# EAGLE design ATSAMD21G18A_Breakout (EAGLE 9.3.2)
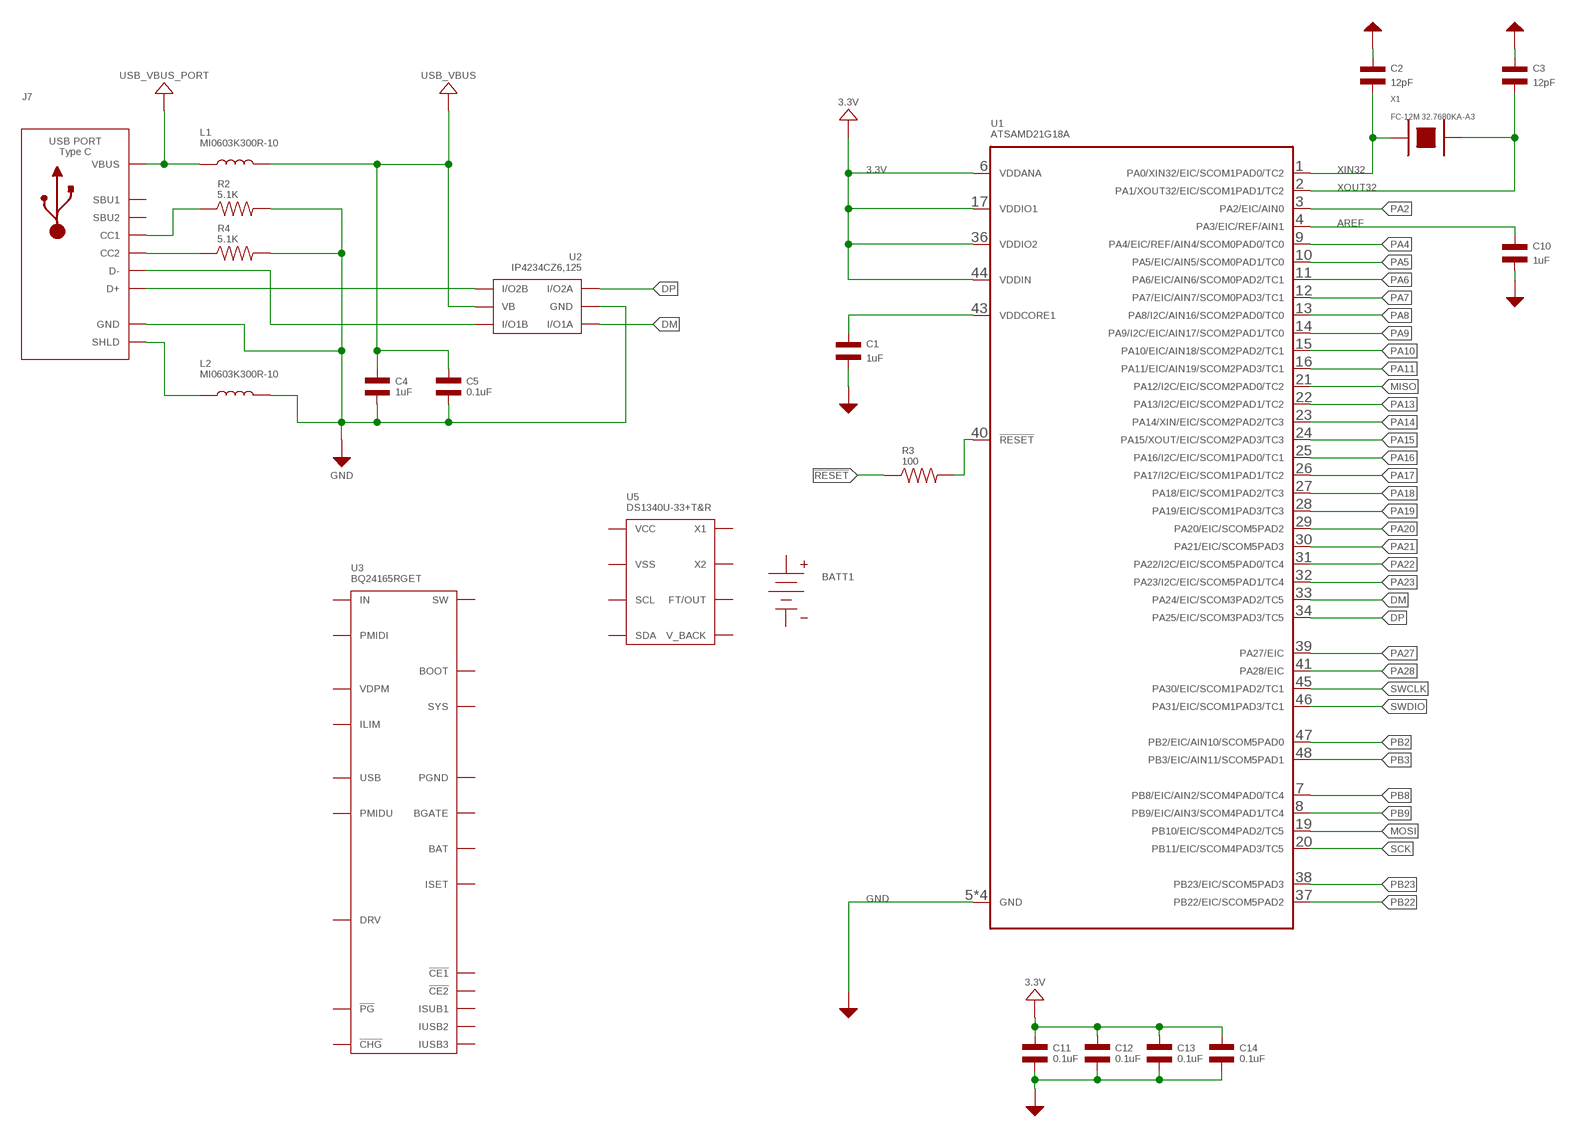
[diagram p0: schematic, sheet 1, part 1 of 2]
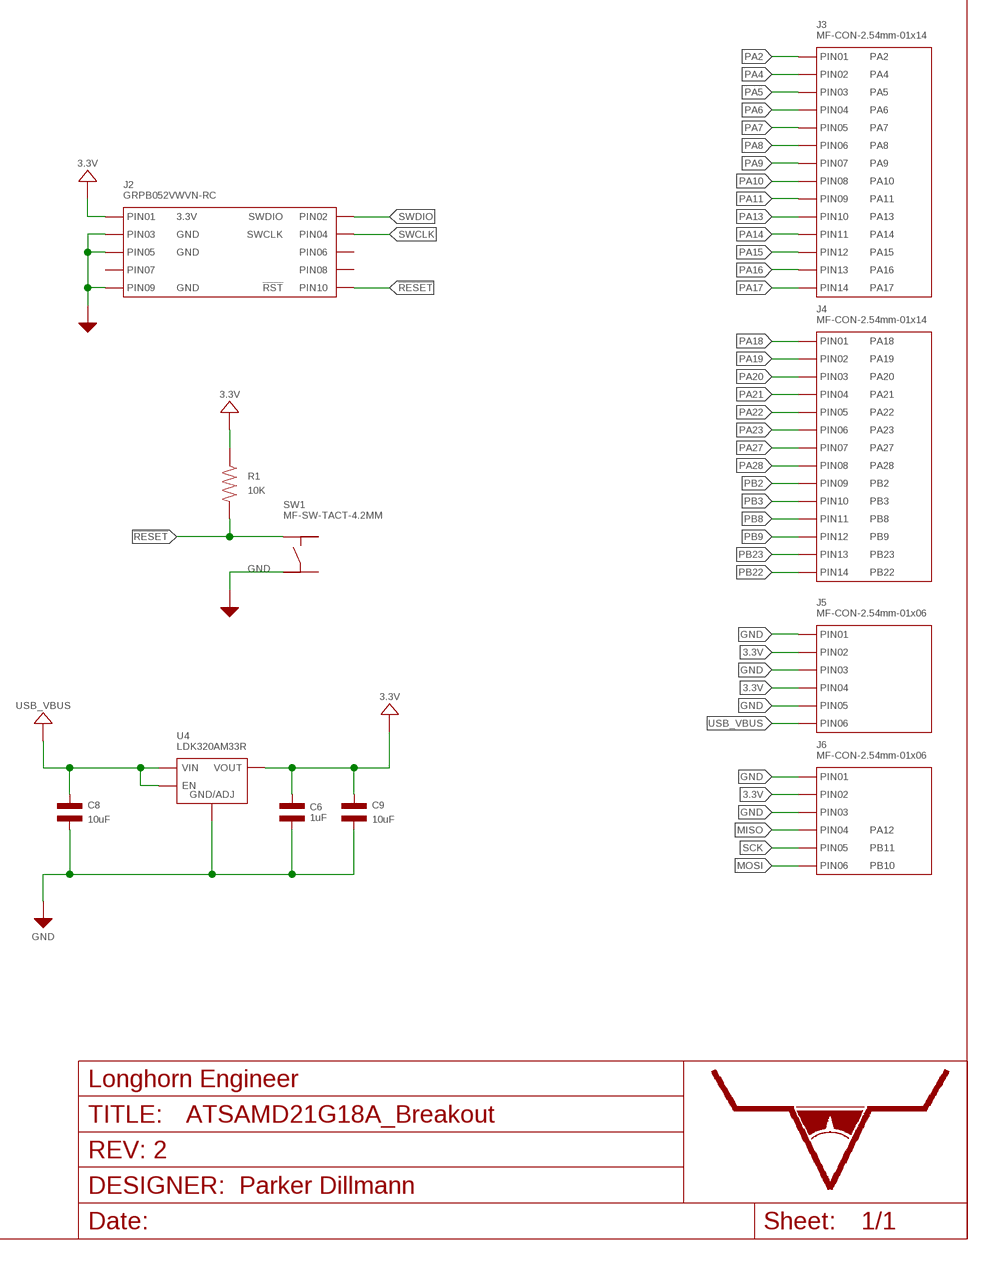
[diagram p1: schematic, sheet 1, part 2 of 2]

## Parts
BATT1  BATTERY_KEYSTONE_1074  [1074]
C1  1uF  CAPACITOR_NP_0402  [C0402]
C2  12pF  CAPACITOR_NP_0402  [C0402]
C3  12pF  CAPACITOR_NP_0402  [C0402]
C4  1uF  CAPACITOR_NP_0402  [C0402]
C5  0.1uF  CAPACITOR_NP_0402  [C0402]
C6  1uF  CAPACITOR_NP_0603  [C0603]
C8  10uF  CAPACITOR_NP_1206  [C1206]
C9  10uF  CAPACITOR_NP_1206  [C1206]
C10  1uF  CAPACITOR_NP_0402  [C0402]
C11  0.1uF  CAPACITOR_NP_0402  [C0402]
C12  0.1uF  CAPACITOR_NP_0402  [C0402]
C13  0.1uF  CAPACITOR_NP_0402  [C0402]
C14  0.1uF  CAPACITOR_NP_0402  [C0402]
J2  GRPB052VWVN-RC  CON_02X05_GRPB052VWVN-RC  [GRPB052VWVN-RC]
J3  MF-CON-2.54mm-01x14  CON_01X14_PTH_2.54MM  [PTH_2.54MM_01X14]
J4  MF-CON-2.54mm-01x14  CON_01X14_PTH_2.54MM  [PTH_2.54MM_01X14]
J5  MF-CON-2.54mm-01x06  CON_01X06_PTH_2.54MM  [PTH_2.54MM_01X06]
J6  MF-CON-2.54mm-01x06  CON_01X06_PTH_2.54MM  [PTH_2.54MM_01X06]
J7  USB_TYPE-C_MINIMAL  [TYPE-C-31-M-12]
L1  MI0603K300R-10  INDUCTOR_0603  [L0603]
L2  MI0603K300R-10  INDUCTOR_0603  [L0603]
R1  10K  RESISTOR_0402  [R0402]
R2  5.1K  RESISTOR_0402  [R0402]
R3  100  RESISTOR_0402  [R0402]
R4  5.1K  RESISTOR_0402  [R0402]
SW1  MF-SW-TACT-4.2MM  TACT_4.2MM  [TACT4.2MM]
U1  ATSAMD21G18A  ATSAMD21G18A-AU  [ATSAMD21G18A_TQFP-48]
U2  IP4234CZ6,125  IP4234CZ6  [IP4234CZ6_SOT-457-6]
U3  BQ24165RGET  [BQ24165_QFN-24]
U4  LDK320AM33R  TLV70233PDBVR  [SOT-23-5]
U5  DS1340U-33+T&R  DS1340ZU-33+  [DS1340Z_USOP]
U$8  LHE_FRAME  [LHE_FRAME]
X1  FC-12M 32.7680KA-A3  CRYSTAL_FC-12M  [FC-12M]

## Nets
3.3V: C6.P$1 C9.P$1 C11.P$1 C12.P$1 C13.P$1 C14.P$1 J2.1(PIN1) J5.P$2(PIN2) J5.P$4(PIN4) J6.P$2(PIN2) R1.P$1 U1.6(VDDANA) U1.17(VDDIO1) U1.36(VDDIO2) U1.44(VDDIN) U4.P$5(VOUT)
!RESET: J2.10(PIN10) R1.P$2 R3.P$1 SW1.P$1
AREF: C10.P$1 U1.4(PA3/EIC/REF/AIN1)
D+: J7.A6(D+) J7.B6(D+) U2.4(I/O2B)
D-: J7.A7(D-) J7.B7(D-) U2.3(I/O1B)
DM: U1.33(PA24/EIC/SCOM3PAD2/TC5) U2.1(I/O1A)
DP: U1.34(PA25/EIC/SCOM3PAD3/TC5) U2.6(I/O2A)
GND: C1.P$2 C2.P$1 C3.P$1 C4.P$2 C5.P$2 C6.P$2 C8.P$2 C9.P$2 C10.P$2 C11.P$2 C12.P$2 C13.P$2 C14.P$2 J2.3(PIN3) J2.5(PIN5) J2.9(PIN9) J5.P$1(PIN1) J5.P$3(PIN3) J5.P$5(PIN5) J6.P$1(PIN1) J6.P$3(PIN3) J7.A1/B12(GND) J7.B1/A12(GND) L2.P$2 R2.P$2 R4.P$2 SW1.P$3 U1.5(GND) U1.18(GND) U1.35(GND) U1.42(GND) U2.2(GND) U4.P$2(GND/ADJ)
MISO: J6.P$4(PIN4) U1.21(PA12/I2C/EIC/SCOM2PAD0/TC2)
MOSI: J6.P$6(PIN6) U1.19(PB10/EIC/SCOM4PAD2/TC5)
N$1: J7.A5(CC1) R2.P$1
N$2: J7.B5(CC2) R4.P$1
PA2: J3.P$1(PIN1) U1.3(PA2/EIC/AIN0)
PA4: J3.P$2(PIN2) U1.9(PA4/EIC/REF/AIN4/SCOM0PAD0/TC0)
PA5: J3.P$3(PIN3) U1.10(PA5/EIC/AIN5/SCOM0PAD1/TC0)
PA6: J3.P$4(PIN4) U1.11(PA6/EIC/AIN6/SCOM0PAD2/TC1)
PA7: J3.P$5(PIN5) U1.12(PA7/EIC/AIN7/SCOM0PAD3/TC1)
PA8: J3.P$6(PIN6) U1.13(PA8/I2C/AIN16/SCOM2PAD0/TC0)
PA9: J3.P$7(PIN7) U1.14(PA9/I2C/EIC/AIN17/SCOM2PAD1/TC0)
PA10: J3.P$8(PIN8) U1.15(PA10/EIC/AIN18/SCOM2PAD2/TC1)
PA11: J3.P$9(PIN9) U1.16(PA11/EIC/AIN19/SCOM2PAD3/TC1)
PA13: J3.P$10(PIN10) U1.22(PA13/I2C/EIC/SCOM2PAD1/TC2)
PA14: J3.P$11(PIN11) U1.23(PA14/XIN/EIC/SCOM2PAD2/TC3)
PA15: J3.P$12(PIN12) U1.24(PA15/XOUT/EIC/SCOM2PAD3/TC3)
PA16: J3.P$13(PIN13) U1.25(PA16/I2C/EIC/SCOM1PAD0/TC1)
PA17: J3.P$14(PIN14) U1.26(PA17/I2C/EIC/SCOM1PAD1/TC2)
PA18: J4.P$1(PIN1) U1.27(PA18/EIC/SCOM1PAD2/TC3)
PA19: J4.P$2(PIN2) U1.28(PA19/EIC/SCOM1PAD3/TC3)
PA20: J4.P$3(PIN3) U1.29(PA20/EIC/SCOM5PAD2)
PA21: J4.P$4(PIN4) U1.30(PA21/EIC/SCOM5PAD3)
PA22: J4.P$5(PIN5) U1.31(PA22/I2C/EIC/SCOM5PAD0/TC4)
PA23: J4.P$6(PIN6) U1.32(PA23/I2C/EIC/SCOM5PAD1/TC4)
PA27: J4.P$7(PIN7) U1.39(PA27/EIC)
PA28: J4.P$8(PIN8) U1.41(PA28/EIC)
PB2: J4.P$9(PIN9) U1.47(PB2/EIC/AIN10/SCOM5PAD0)
PB3: J4.P$10(PIN10) U1.48(PB3/EIC/AIN11/SCOM5PAD1)
PB8: J4.P$11(PIN11) U1.7(PB8/EIC/AIN2/SCOM4PAD0/TC4)
PB9: J4.P$12(PIN12) U1.8(PB9/EIC/AIN3/SCOM4PAD1/TC4)
PB22: J4.P$14(PIN14) U1.37(PB22/EIC/SCOM5PAD2)
PB23: J4.P$13(PIN13) U1.38(PB23/EIC/SCOM5PAD3)
RESETLIN: R3.P$2 U1.40(!RESET)
SCK: J6.P$5(PIN5) U1.20(PB11/EIC/SCOM4PAD3/TC5)
SHEILD2: J7.MT_B_0(SHLD) J7.MT_B_1(SHLD) J7.MT_B_2(SHLD) J7.MT_B_3(SHLD) J7.MT_T_0(SHLD) J7.MT_T_1(SHLD) J7.MT_T_2(SHLD) J7.MT_T_3(SHLD) L2.P$1
SWCLK: J2.4(PIN4) U1.45(PA30/EIC/SCOM1PAD2/TC1)
SWDIO: J2.2(PIN2) U1.46(PA31/EIC/SCOM1PAD3/TC1)
USB_VBUS: C4.P$1 C5.P$1 C8.P$1 J5.P$6(PIN6) L1.P$2 U2.5(VB) U4.P$1(VIN) U4.P$3(EN)
USB_VBUS_PORT: J7.A4/B9(VBUS) J7.B4/A9(VBUS) L1.P$1
VDDCORE: C1.P$1 U1.43(VDDCORE1)
XIN32: C2.P$2 U1.1(PA0/XIN32/EIC/SCOM1PAD0/TC2) X1.P$1
XOUT32: C3.P$2 U1.2(PA1/XOUT32/EIC/SCOM1PAD1/TC2) X1.P$2
Unconnected: BATT1.+ BATT1.-1(-) BATT1.-2(-) J2.6(PIN6) J2.7(PIN7) J2.8(PIN8) J7.A8(SBU1) J7.B8(SBU2) SW1.P$2 SW1.P$4 U3.1(VDPM) U3.2(IUSB3) U3.3(IUSB2) U3.4(ISUB1) U3.5(ISET) U3.6(DRV) U3.7(!PG) U3.8(!CHG) U3.9(!CE2) U3.10(BGATE) U3.11(BAT) U3.12(BAT) U3.13(SYS) U3.14(SYS) U3.15(ILIM) U3.16(PGND) U3.17(PGND) U3.18(SW) U3.19(BOOT) U3.20(PMIDI) U3.21(IN) U3.22(USB) U3.23(PMIDU) U3.24(!CE1) U3.PAD(PGND) U5.1(X1) U5.2(X2) U5.3(V_BACK) U5.4(VSS) U5.5(SDA) U5.6(SCL) U5.7(FT/OUT) U5.8(VCC)

## Library data of the parts
BATT1 = PP_Connectors:BATTERY
C1 C4 C6 C10 = MF_Passives:CAPACITOR_NP: Library: MF_Passives Description: Device for Non-Polarized Capacitors. Manufacture part number (MPN) can be added via Attributes. Check https://factory.macrofab.com/parts for the house parts list.; MPN: MF-CAP-0603-1uF; POPULATE: 1
C2 C3 = MF_Passives:CAPACITOR_NP: Library: MF_Passives Description: Device for Non-Polarized Capacitors. Manufacture part number (MPN) can be added via Attributes. Check https://factory.macrofab.com/parts for the house parts list.; MPN: CC0603JRNPO9BN120; POPULATE: 1
C5 C11-C14 = MF_Passives:CAPACITOR_NP: Library: MF_Passives Description: Device for Non-Polarized Capacitors. Manufacture part number (MPN) can be added via Attributes. Check https://factory.macrofab.com/parts for the house parts list.; MPN: MF-CAP-0603-0.1uF; POPULATE: 1
C8 C9 = MF_Passives:CAPACITOR_NP: Library: MF_Passives Description: Device for Non-Polarized Capacitors. Manufacture part number (MPN) can be added via Attributes. Check https://factory.macrofab.com/parts for the house parts list.; MPN: MF-CAP-1206-10uF; POPULATE: 1
J2 = PP_Connectors:CON_02X05; LABEL01: 3.3V; LABEL02: SWDIO; LABEL03: GND; LABEL04: SWCLK; LABEL05: GND; LABEL09: GND; LABEL10: !RST; MPN: GRPB052VWVN-RC; POPULATE: 1
J3 = MF_Connectors:CON_01X14: Library: MF_Connectors Description: Header Connector with 14 Positions and 01 Rows. Use the LABEL Attribute to label the pin on the schematic and PCB. You can remove the attributes on the PCB by using the SMASH function on the part and then deleting the text.; HOUSEPART: YES; LABEL01: PA2; LABEL02: PA4; LABEL03: PA5; LABEL04: PA6; LABEL05: PA7; LABEL06: PA8; LABEL07: PA9; LABEL08: PA10; LABEL09: PA11; LABEL10: PA13; LABEL11: PA14; LABEL12: PA15; LABEL13: PA16; LABEL14: PA17; MPN: MF-CON-2.54mm-01x14; POPULATE: 1; URL: https://factory.macrofab.com/part/MF-CON-2.54mm-01x14
J4 = MF_Connectors:CON_01X14: Library: MF_Connectors Description: Header Connector with 14 Positions and 01 Rows. Use the LABEL Attribute to label the pin on the schematic and PCB. You can remove the attributes on the PCB by using the SMASH function on the part and then deleting the text.; HOUSEPART: YES; LABEL01: PA18; LABEL02: PA19; LABEL03: PA20; LABEL04: PA21; LABEL05: PA22; LABEL06: PA23; LABEL07: PA27; LABEL08: PA28; LABEL09: PB2; LABEL10: PB3; LABEL11: PB8; LABEL12: PB9; LABEL13: PB23; LABEL14: PB22; MPN: MF-CON-2.54mm-01x14; POPULATE: 1; URL: https://factory.macrofab.com/part/MF-CON-2.54mm-01x14
J5 = MF_Connectors:CON_01X06: Library: MF_Connectors Description: Header Connector with 6 Positions and 01 Rows. Use the LABEL Attribute to label the pin on the schematic and PCB. You can remove the attributes on the PCB by using the SMASH function on the part and then deleting the text.; HOUSEPART: YES; MPN: MF-CON-2.54mm-01x06; POPULATE: 1; URL: https://factory.macrofab.com/part/MF-CON-2.54mm-01x06
J6 = MF_Connectors:CON_01X06: Library: MF_Connectors Description: Header Connector with 6 Positions and 01 Rows. Use the LABEL Attribute to label the pin on the schematic and PCB. You can remove the attributes on the PCB by using the SMASH function on the part and then deleting the text.; HOUSEPART: YES; LABEL04: PA12; LABEL05: PB11; LABEL06: PB10; MPN: MF-CON-2.54mm-01x06; POPULATE: 1; URL: https://factory.macrofab.com/part/MF-CON-2.54mm-01x06
J7 = PP_Connectors:USB_TYPE-C_MINIMAL
L1 L2 = MF_Passives:INDUCTOR: Library: MF_Passives Description: Device for Inductors. Manufacture part number (MPN) can be added via Attributes. Check https://factory.macrofab.com/parts for the house parts list.; MPN: MI0603K300R-10; POPULATE: 1
R1 = MF_Passives:RESISTOR: Library: MF_Passives Description: Device for Resistors. Manufacture part number (MPN), Voltage, Tolerance, and Wattage Rating can be added via Attributes. Check https://factory.macrofab.com/parts for the house parts list.; MPN: MF-RES-0603-10K; POPULATE: 1
R2 R4 = MF_Passives:RESISTOR: Library: MF_Passives Description: Device for Resistors. Manufacture part number (MPN), Voltage, Tolerance, and Wattage Rating can be added via Attributes. Check https://factory.macrofab.com/parts for the house parts list.; MPN: ERJ-3EKF5101V; POPULATE: 1
R3 = MF_Passives:RESISTOR: Library: MF_Passives Description: Device for Resistors. Manufacture part number (MPN), Voltage, Tolerance, and Wattage Rating can be added via Attributes. Check https://factory.macrofab.com/parts for the house parts list.; MPN: MF-RES-0603-100; POPULATE: 1
SW1 = MF_Switches:TACT: Library: MF_Switches Description: Device for Tact Switches. Manufacture part number (MFG#) can be added via Attributes.; HOUSEPART: YES; MPN: MF-SW-TACT-4.2MM; POPULATE: 1; URL: https://factory.macrofab.com/part/MF-SW-TACT-4.2MM
U1 = PP_DigitalIC:ATSAMD21G18A; MPN: ATSAMD21G18A-AU
U2 = PP_Passives:IP4234CZ6: Mouser Part #: 771-IP4234CZ6125 Manufacturer Part #: IP4234CZ6,125 Manufacturer: NXP Semiconductors Description: ESD Suppressors Single USB 2.0 ESD Protection 6-Pin http://www.mouser.com/ProductDetail/NXP-Semiconductors/IP4234CZ6125/?qs=sGAEpiMZZMvxHShE6Whpu7QUdHOfUl1T0xbl582qhFk%3d; MPN: IP4234CZ6,125
U3 = PP_PowerIC:BQ24165; MFG: Texas Instruments; MPN: BQ24165RGET; POPULATE: 1
U4 = MF_IC_Power:TLV702: Manufacturer Part #: TLV702 Manufacturer: Texas Instruments Description: LDO Voltage Regulators; HOUSEPART: No; MPN: LDK320AM33R; POPULATE: 1; VALUE: MF-REG-SOT235-3.3V-300mA
U5 = PP_DigitalIC:DS1340Z: Manufacturer Part #: DS1340Z Manufacturer: Maxim Integrated Description: Real Time Clock I2C RTC w/Trickle Charger; MPN: DS1340U-33+T&R
U$8 = PP_Aesthetics:LHE_FRAME; DNAME: Parker Dillmann; REVNUM: REV: 2
X1 = PP_FreqCtrl:CRYSTAL; MPN: FC-12M 32.7680KA-A3

## Board
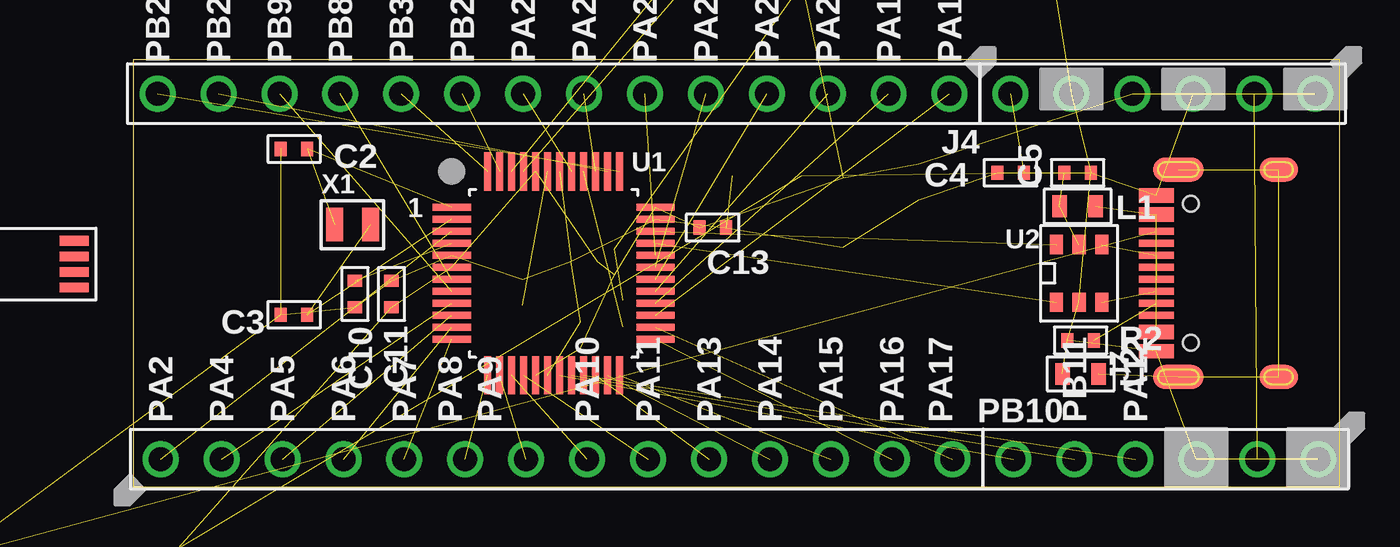
[diagram p2: board, top side]
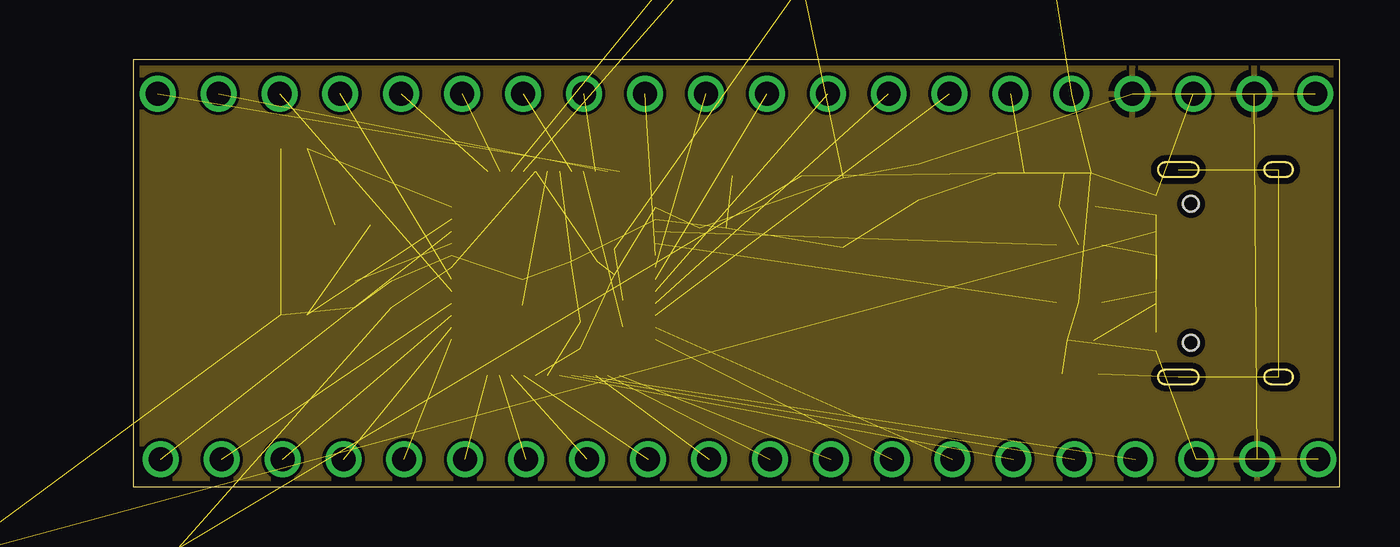
[diagram p3: board, inner layer Route2]
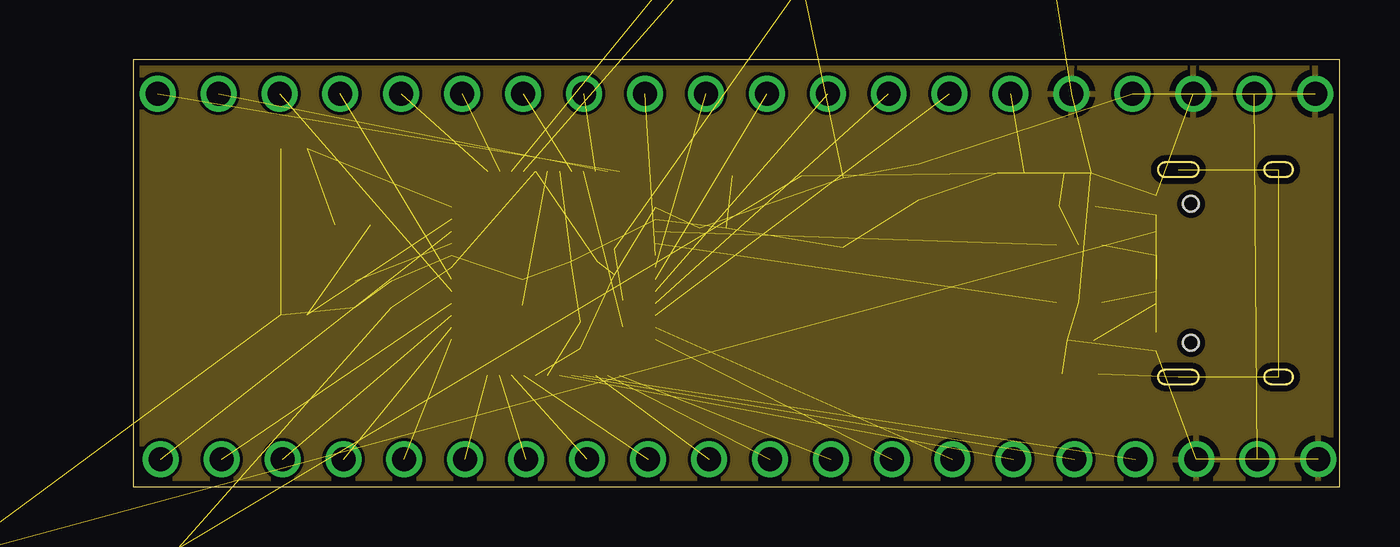
[diagram p4: board, inner layer Route15]
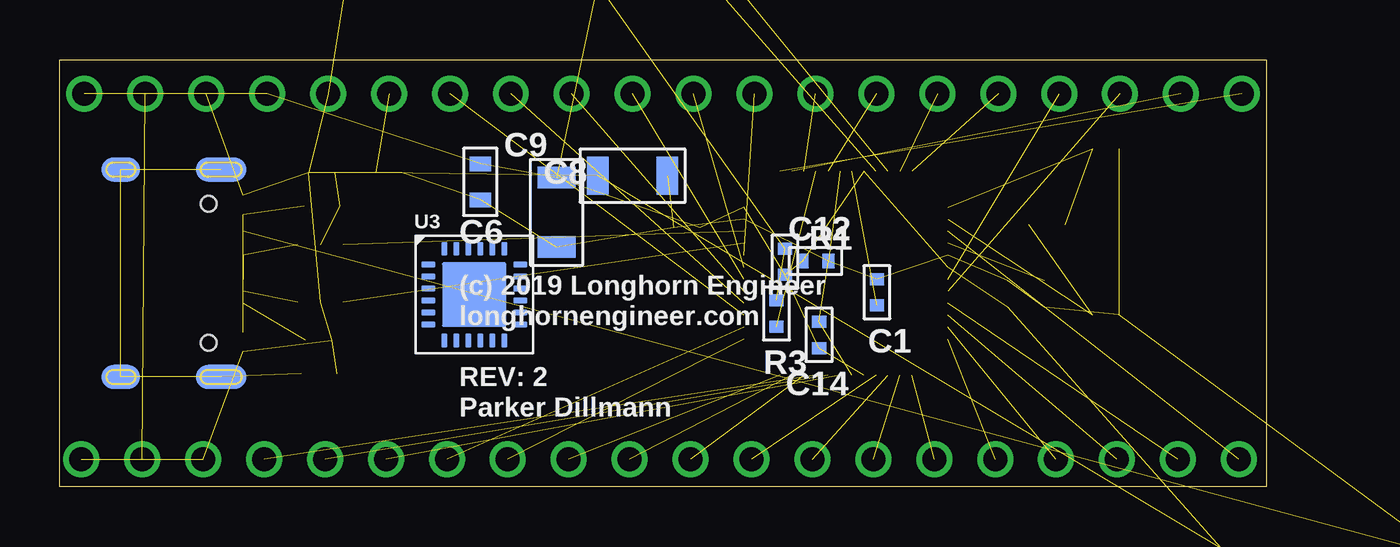
[diagram p5: board, bottom side, seen from below]

Size 50.29 x 17.78 mm. Coordinates in mm from the lower left corner, seen from the top.
Outline: 0,0 50.29,0 50.29,17.78 0,17.78 0,0
Copper layers (1*2*15*16): Top 0.035mm / dielectric 0.23mm / Route2 0.035mm / dielectric 0.93mm / Route15 0.035mm / dielectric 0.23mm / Bottom 0.035mm
Design rules "MF_Standard_4_Layer": minimum track width 5mil, minimum drill 10mil, track to track 5mil, track to pad 5mil, pad to pad 5mil, via to via 5mil, smd to smd 0mil, copper to edge 10mil, drill to drill 10mil, minimum pad ring 4mil, minimum via ring 4mil, stop-mask expansion 2mil, vias tented up to drill 25mil, thermal gap 10mil

### Footprints (pad centres in the part's own frame; a part is rotated, then mirrored left to right if it is on the bottom)
1074 = drill 1.295: + 0,-1.9; -2 5,1.9 | drill 1.295 square: -1 -5,1.9
C0402 = smd 0.5 x 0.6: P$1 -0.55,0; P$2 0.55,0
C0603 = smd 0.6 x 0.9: P$1 -0.75,0; P$2 0.75,0
C1206 = smd 0.9 x 1.6: P$1 -1.45,0; P$2 1.45,0
GRPB052VWVN-RC = drill 0.711 pad 1.016: 1 -2.54,-0.635; 2 -2.54,0.635; 3 -1.27,-0.635; 4 -1.27,0.635; 5 0,-0.635; 6 0,0.635; 7 1.27,-0.635; 8 1.27,0.635; 9 2.54,-0.635; 10 2.54,0.635
PTH_2.54MM_01X14 = drill 1: P$1 -16.51,0; P$2 -13.97,0; P$3 -11.43,0; P$4 -8.89,0; P$5 -6.35,0; P$6 -3.81,0; P$7 -1.27,0; P$8 1.27,0; P$9 3.81,0; P$10 6.35,0; P$11 8.89,0; P$12 11.43,0; P$13 13.97,0; P$14 16.51,0
PTH_2.54MM_01X06 = drill 1: P$1 -6.35,0; P$2 -3.81,0; P$3 -1.27,0; P$4 1.27,0; P$5 3.81,0; P$6 6.35,0
TYPE-C-31-M-12 = smd 0.6 x 1.45: A1/B12 -3.25,5.095; A4/B9 -2.45,5.095; B1/A12 3.25,5.095; B4/A9 2.45,5.095 | smd 0.3 x 1.45: A5 -1.25,5.095; A6 -0.25,5.095; A7 0.25,5.095; A8 1.25,5.095; B5 1.75,5.095; B6 0.75,5.095; B7 -0.75,5.095; B8 -1.75,5.095 | smd 1 x 2.1 bottom: MT_B_0 -4.32,4.18; MT_B_1 4.32,4.18 | smd 1 x 1.6 bottom: MT_B_2 -4.32,0; MT_B_3 4.32,0 | smd 1 x 2.1: MT_T_0 -4.32,4.18; MT_T_1 4.32,4.18 | smd 1 x 1.6: MT_T_2 -4.32,0; MT_T_3 4.32,0 | hole 0.65: -2.89,3.65; 2.89,3.65
L0603 = smd 0.6 x 0.9: P$1 -0.75,0; P$2 0.75,0
R0402 = smd 0.5 x 0.6: P$1 -0.55,0; P$2 0.55,0
TACT4.2MM = smd 1.05 x 0.65: P$1 -2.075,1.075; P$2 2.075,1.075; P$3 -2.075,-1.075; P$4 2.075,-1.075
ATSAMD21G18A_TQFP-48 = smd 1.6 x 0.3: 1 -4.25,2.75; 2 -4.25,2.25; 3 -4.25,1.75; 4 -4.25,1.25; 5 -4.25,0.75; 6 -4.25,0.25; 7 -4.25,-0.25; 8 -4.25,-0.75; 9 -4.25,-1.25; 10 -4.25,-1.75; 11 -4.25,-2.25; 12 -4.25,-2.75; 25 4.25,-2.75; 26 4.25,-2.25; 27 4.25,-1.75; 28 4.25,-1.25; 29 4.25,-0.75; 30 4.25,-0.25; 31 4.25,0.25; 32 4.25,0.75; 33 4.25,1.25; 34 4.25,1.75; 35 4.25,2.25; 36 4.25,2.75 | smd 0.3 x 1.6: 13 -2.75,-4.25; 14 -2.25,-4.25; 15 -1.75,-4.25; 16 -1.25,-4.25; 17 -0.75,-4.25; 18 -0.25,-4.25; 19 0.25,-4.25; 20 0.75,-4.25; 21 1.25,-4.25; 22 1.75,-4.25; 23 2.25,-4.25; 24 2.75,-4.25; 37 2.75,4.25; 38 2.25,4.25; 39 1.75,4.25; 40 1.25,4.25; 41 0.75,4.25; 42 0.25,4.25; 43 -0.25,4.25; 44 -0.75,4.25; 45 -1.25,4.25; 46 -1.75,4.25; 47 -2.25,4.25; 48 -2.75,4.25
IP4234CZ6_SOT-457-6 = smd 0.8 x 0.55: 1 -1.2,0.95; 2 -1.2,0; 3 -1.2,-0.95; 4 1.2,-0.95; 5 1.2,0; 6 1.2,0.95
BQ24165_QFN-24 = smd 0.58 x 0.24: 1 -1.913,1.25; 2 -1.913,0.75; 3 -1.913,0.25; 4 -1.913,-0.25; 5 -1.913,-0.75; 6 -1.913,-1.25; 13 1.913,-1.25; 14 1.913,-0.75; 15 1.913,-0.25; 16 1.913,0.25; 17 1.913,0.75; 18 1.913,1.25 | smd 0.24 x 0.58: 7 -1.25,-1.913; 8 -0.75,-1.913; 9 -0.25,-1.913; 10 0.25,-1.913; 11 0.75,-1.913; 12 1.25,-1.913; 19 1.25,1.913; 20 0.75,1.913; 21 0.25,1.913; 22 -0.25,1.913; 23 -0.75,1.913; 24 -1.25,1.913 | smd 2.7 x 2.7: PAD 0,0
SOT-23-5 = smd 1.05 x 0.6: P$1 -1.35,0.95; P$2 -1.35,0; P$3 -1.35,-0.95; P$4 1.35,-0.95; P$5 1.35,0.95
DS1340Z_USOP = smd 1.2 x 0.4: 1 -2.5,0.975; 2 -2.5,0.325; 3 -2.5,-0.325; 4 -2.5,-0.975; 5 2.5,-0.975; 6 2.5,-0.325; 7 2.5,0.325; 8 2.5,0.975
FC-12M = smd 0.7 x 1.4: P$1 -0.75,0; P$2 0.75,0

### Placement (x,y rotation side)
BATT1  -14.73,17.02 0 top  (outside the outline)
C1  16.23,8.1 90 bottom
C2  6.71,14.07 0 top
C3  6.71,7.16 0 top
C4  36.58,13.08 180 top
C5  39.37,13.08 0 top
C6  32.77,12.7 270 bottom
C8  26.42,12.95 0 bottom
C9  29.59,11.43 270 bottom
C10  9.25,8.03 270 top
C11  10.77,8.03 90 top
C12  18.8,9.4 0 bottom
C13  24.16,10.79 0 top
C14  18.64,6.32 90 bottom
J2  29.46,26.16 0 top  (outside the outline)
J3  17.65,1.14 0 top
J4  17.53,16.38 180 top
J5  42.93,16.38 180 top
J6  43.05,1.14 180 top
J7  47.75,8.89 90 top
L1  39.37,11.68 180 top
L2  39.5,4.7 180 top
R1  20.07,9.37 90 bottom
R2  39.5,6.1 180 top
R3  20.42,7.21 270 bottom
R4  -8.76,-3.43 0 top  (outside the outline)
SW1  36.83,26.04 90 top  (outside the outline)
U1  17.53,8.89 0 top
U2  39.43,8.89 90 top
U3  33.02,8 0 bottom
U4  -2.54,-6.99 0 top  (outside the outline)
U5  -4.95,9.27 0 top
U$8  33.66,2.92 0 bottom
X1  9.14,10.92 0 top

### Tracks (layer width: path | path; a pad name or v marks a point on that pad's centre or on a via)
3.3V  (15 unrouted)
  pour Route2: 0,17.65 0,0 50.93,0 50.93,17.65
!RESET  (3 unrouted)
AREF  (1 unrouted)
D+  (2 unrouted)
D-  (2 unrouted)
DM  (1 unrouted)
DP  (1 unrouted)
GND  (32 unrouted)
  pour Route15: 50.93,17.65 50.93,0 0,0 0,17.65
MISO  (1 unrouted)
MOSI  (1 unrouted)
N$1  (1 unrouted)
N$2  (1 unrouted)
PA2  (1 unrouted)
PA4  (1 unrouted)
PA5  (1 unrouted)
PA6  (1 unrouted)
PA7  (1 unrouted)
PA8  (1 unrouted)
PA9  (1 unrouted)
PA10  (1 unrouted)
PA11  (1 unrouted)
PA13  (1 unrouted)
PA14  (1 unrouted)
PA15  (1 unrouted)
PA16  (1 unrouted)
PA17  (1 unrouted)
PA18  (1 unrouted)
PA19  (1 unrouted)
PA20  (1 unrouted)
PA21  (1 unrouted)
PA22  (1 unrouted)
PA23  (1 unrouted)
PA27  (1 unrouted)
PA28  (1 unrouted)
PB2  (1 unrouted)
PB3  (1 unrouted)
PB8  (1 unrouted)
PB9  (1 unrouted)
PB22  (1 unrouted)
PB23  (1 unrouted)
RESETLIN  (1 unrouted)
SCK  (1 unrouted)
SHEILD2  (8 unrouted)
SWCLK  (1 unrouted)
SWDIO  (1 unrouted)
USB_VBUS  (7 unrouted)
USB_VBUS_PORT  (2 unrouted)
VDDCORE  (1 unrouted)
XIN32  (2 unrouted)
XOUT32  (2 unrouted)